# Altium schematic sheet DBUS_PPM.SchDoc
size A4
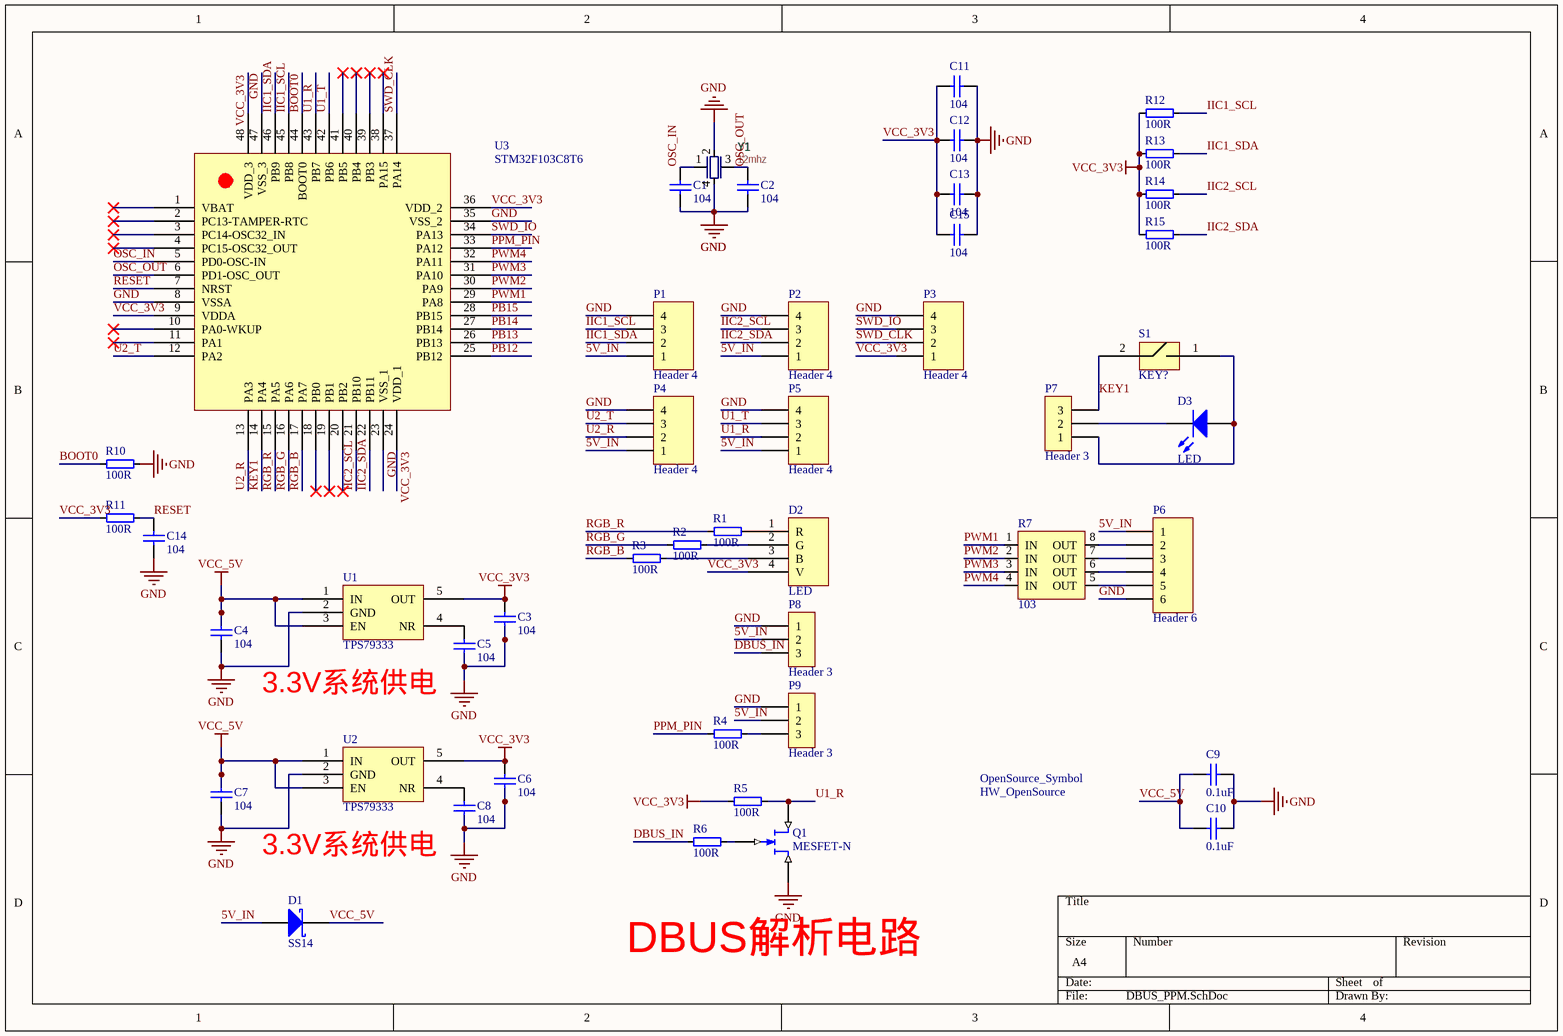
[diagram p0: DBUS_PPM.SchDoc]

## Parts
?  HW_OpenSource  [OSHW-LOGO-S]
C1  104  [0603-C]
C2  104  [0603-C]
C3  104  [0603-C]
C4  104  [0603-C]
C5  104  [0603-C]
C6  104  [0603-C]
C7  104  [0603-C]
C8  104  [0603-C]
C9  0.1uF  [1206-C]
C10  0.1uF  [1206-C]
C11  104  [0603-C]
C12  104  [0603-C]
C13  104  [0603-C]
C14  104  [0603-C]
C15  104  [0603-C]
D1  SS14  [SOD-123]
D2  LED  [RGB_LED_V]
D3  LED  [LED_0603_RED]
P1  Header 4  [SMT1.25_4P-90]
P2  Header 4  [SMT1.25_4P-90]
P3  Header 4  [SMT1.25_4P-90]
P4  Header 4  [SMT1.25_4P-90]
P5  Header 4  [SMT1.25_4P-90]
P6  Header 6  [SMT1.25_6P-90]
P7  Header 3  [TestPoint*3]
P8  Header 3  [Pad_2.54*3]
P9  Header 3  [Pad_2.54*3]
Q1  MESFET-N  [SOT23-3]
R1  100R  [0603-R]
R2  100R  [0603-R]
R3  100R  [0603-R]
R4  100R  [0603-R]
R5  100R  [0603-R]
R6  100R  [0603-R]
R7  103  [0603*4排阻]
R10  100R  [0603-R]
R11  100R  [0603-R]
R12  100R  [0603-R]
R13  100R  [0603-R]
R14  100R  [0603-R]
R15  100R  [0603-R]
S1  KEY?  [Micro-Key]
U1  TPS79333  [SOT23-5]
U2  TPS79333  [SOT23-5]
U3  STM32F103C8T6  [LQFP48]
Y1  12mhz  [OSC-3225]

## Nets
GND: C1.1 C2.1 C3.1 C4.1 C5.1 C6.1 C7.1 C8.1 C9.2 C10.2 C11.2 C12.2 C13.2 C14.1 C15.2 P1.4 P2.4 P3.4 P4.4 P5.4 P6.6 P8.1 P9.1 Q1.3(S) R10.2 U1.2(GND) U2.2(GND) U3.8(VSSA) U3.23(VSS_1) U3.35(VSS_2) U3.47(VSS_3) Y1.2 Y1.4
VCC_3V3: C3.2 C6.2 C11.1 C12.1 C13.1 C15.1 D2.4(V) P3.1 R5.1 R11.1 R12.2 R13.2 R14.2 R15.2 U1.5(OUT) U2.5(OUT) U3.9(VDDA) U3.24(VDD_1) U3.36(VDD_2)
VCC_5V: C4.2 C7.2 C9.1 C10.1 D1.2(K) U1.1(IN) U1.3(EN) U2.1(IN) U2.3(EN)
5V_IN: D1.1(A) P1.1 P2.1 P4.1 P5.1 P6.1 P8.2 P9.2
BOOT0: R10.1 U3.44(BOOT0)
DBUS_IN: P8.3 R6.1
IIC1_SCL: P1.3 R12.1 U3.45(PB8)
IIC1_SDA: P1.2 R13.1 U3.46(PB9)
IIC2_SCL: P2.3 R14.1 U3.21(PB10)
IIC2_SDA: P2.2 R15.1 U3.22(PB11)
KEY1: P7.3 S1.2 U3.14(PA4)
OSC_IN: C1.2 U3.5(PD0-OSC-IN) Y1.1
OSC_OUT: C2.2 U3.6(PD1-OSC_OUT) Y1.3
PB12: U3.25(PB12)
PB13: U3.26(PB13)
PB14: U3.27(PB14)
PB15: U3.28(PB15)
PPM_PIN: R4.1 U3.33(PA12)
PWM1: R7.1(IN) U3.29(PA8)
PWM2: R7.2(IN) U3.30(PA9)
PWM3: R7.3(IN) U3.31(PA10)
PWM4: R7.4(IN) U3.32(PA11)
RESET: C14.2 R11.2 U3.7(NRST)
RGB_B: R3.1 U3.17(PA7)
RGB_G: R2.1 U3.16(PA6)
RGB_R: R1.1 U3.15(PA5)
SWD_CLK: P3.2 U3.37(PA14)
SWD_IO: P3.3 U3.34(PA13)
U1_R: P5.2 Q1.1(D) R5.2 U3.43(PB7)
U1_T: P5.3 U3.42(PB6)
U2_R: P4.2 U3.13(PA3)
U2_T: P4.3 U3.12(PA2)
NetC5_2: C5.2 U1.4(NR)
NetC8_2: C8.2 U2.4(NR)
NetD2_1: D2.1(R) R1.2
NetD2_2: D2.2(G) R2.2
NetD2_3: D2.3(B) R3.2
NetD3_1: D3.1(A) P7.1 S1.1
NetD3_2: D3.2(K) P7.2
NetP6_2: P6.2 R7.8(OUT)
NetP6_3: P6.3 R7.7(OUT)
NetP6_4: P6.4 R7.6(OUT)
NetP6_5: P6.5 R7.5(OUT)
NetP9_3: P9.3 R4.2
NetQ1_2: Q1.2(G) R6.2

Not connected (* = marked no-connect by the designer): U3 1(VBAT)* 2(PC13-TAMPER-RTC)* 3(PC14-OSC32_IN)* 4(PC15-OSC32_OUT)* 10(PA0-WKUP)* 11(PA1)* 18(PB0)* 19(PB1)* 20(PB2)* 38(PA15)* 39(PB3)* 40(PB4)* 41(PB5)* 48(VDD_3)

## Notes on the sheet
- 3.3V系统供电
- DBUS解析电路
- Labels drawn without touching a wire or pin: VCC_3V3
- (in symbol HW_OpenSource) OpenSource_Symbol

## Library data of the parts
? = HW_OpenSource: Hardware Opensource logo
C1-C8 C11-C15 = CAP: 0603
C9 C10 = Cap_2: 1206
D1 = D Schottky: Schottky Diode; Published: 8-Jun-2000; LatestRevisionDate: 17-Jul-2002; LatestRevisionNote: Re-released for DXP Platform.; PackageReference: SMB; Publisher: Altium Limited; Code_JEDEC: DO-214-AA
D2 = LED_RGB
D3 = LED-0603
P1-P5 = Header 4: Header, 4-Pin; LatestRevisionDate: 17-Jul-2002; LatestRevisionNote: Re-released for DXP Platform.; Publisher: Altium Limited
P6 = Header 6: Header, 6-Pin; LatestRevisionDate: 17-Jul-2002; LatestRevisionNote: Re-released for DXP Platform.; Publisher: Altium Limited
P7-P9 = Header 3: Header, 3-Pin; LatestRevisionDate: 17-Jul-2002; LatestRevisionNote: Re-released for DXP Platform.; Publisher: Altium Limited
Q1 = MOSFET-N: N-AO_3400a; Published: 8-Jun-2000; LatestRevisionDate: 17-Jul-2002; LatestRevisionNote: Re-released for DXP Platform.; PackageReference: TO-18; Publisher: Altium Limited; PackageDescription: Can; 3 Leads; Pin Circle Dia. 2.54 mm; Lead Dia. 0.48 mm (max); Code_JEDEC: TO-18
R1-R6 R10-R15 = RES: 0603_R
R7 = RES_0603*4: 0603排阻
S1 = SMD_Key
U1 U2 = TPS79330
Y1 = XTAL: =Description